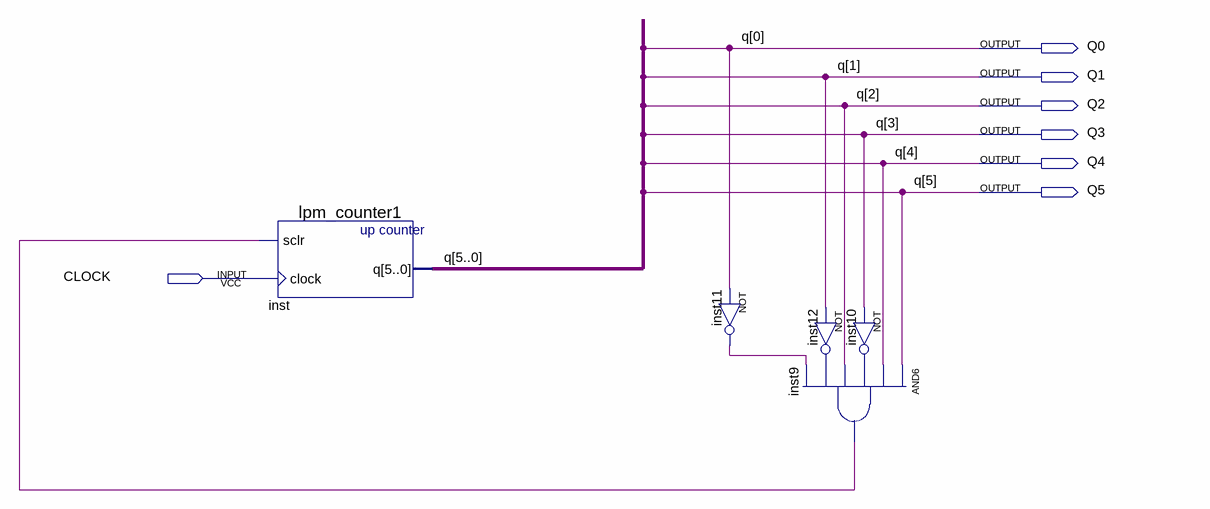
[diagram p0: schematic sheet]
// Quartus schematic cont52.bdf as structural Verilog: 5 symbols, 7 pins
module cont52 (
  input  CLOCK,
  output Q0,
  output Q1,
  output Q2,
  output Q3,
  output Q4,
  output Q5
);

  wire inst9_out, inst10_out, inst11_out, inst12_out;

  lpm_counter1 inst (.sclr(inst9_out), .clock(CLOCK), .q({Q5, Q4, Q3, Q2, Q1, Q0}));
  not inst11 (inst11_out, Q0);
  not inst12 (inst12_out, Q1);
  and inst9 (inst9_out, Q5, Q4, inst10_out, Q2, inst12_out, inst11_out);
  not inst10 (inst10_out, Q3);
endmodule
